# EAGLE design 20191118_GantryControl_v2 (EAGLE 9.5.1)
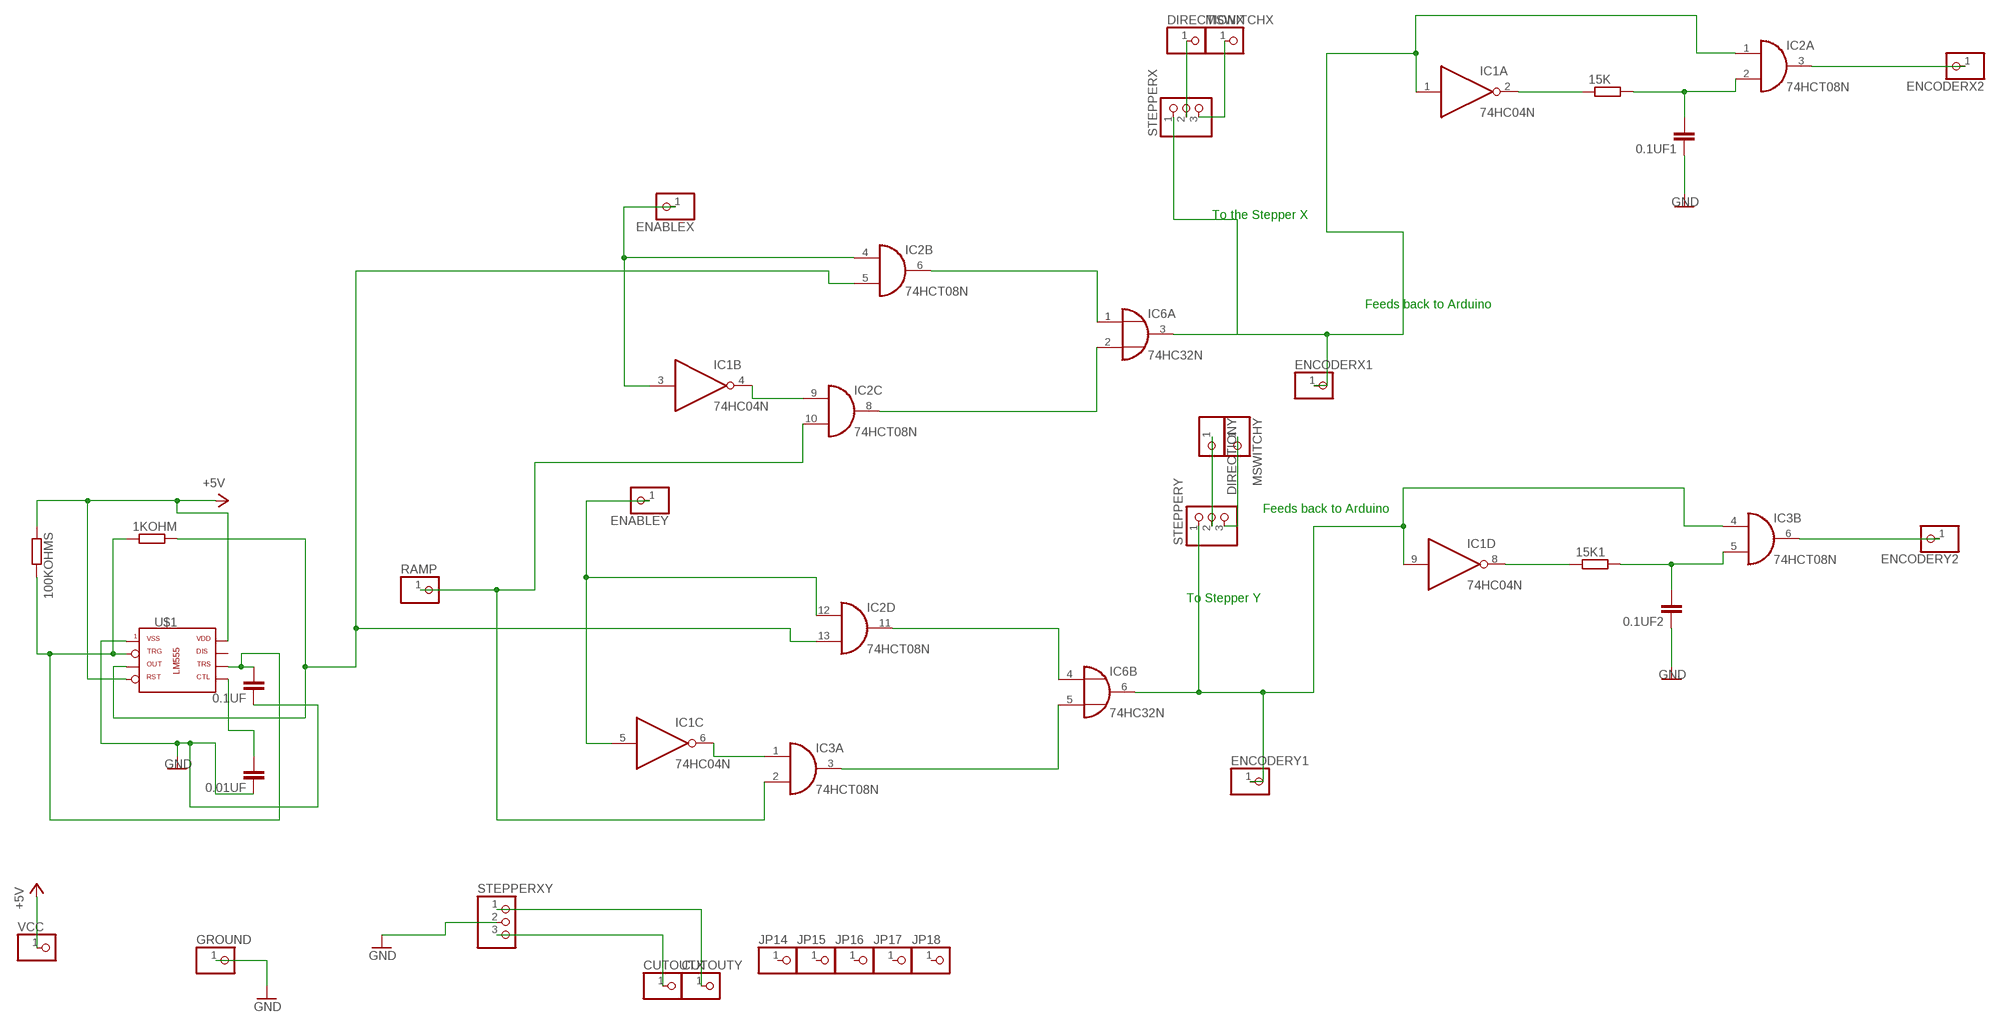
[diagram p0: schematic, sheet 1]

## Parts
0.01UF  C-EU102-064X133  [C102-064X133]
0.1UF  C-EU075-032X103  [C075-032X103]
0.1UF1  C-EU075-032X103  [C075-032X103]
0.1UF2  C-EU075-032X103  [C075-032X103]
1KOHM  R-EU_0207/12  [0207/12]
15K  R-EU_0207/10  [0207/10]
15K1  R-EU_0207/10  [0207/10]
100KOHMS  R-EU_0207/10  [0207/10]
CUTOUTX  PINHD-1X1  [1X01]
CUTOUTY  PINHD-1X1  [1X01]
DIRECTIONX  PINHD-1X1  [1X01]
DIRECTIONY  PINHD-1X1  [1X01]
ENABLEX  PINHD-1X1  [1X01]
ENABLEY  PINHD-1X1  [1X01]
ENCODERX1  PINHD-1X1  [1X01]
ENCODERX2  PINHD-1X1  [1X01]
ENCODERY1  PINHD-1X1  [1X01]
ENCODERY2  PINHD-1X1  [1X01]
GROUND  PINHD-1X1  [1X01]
IC1  74HC04N  [DIL14]
IC2  74HCT08N  [DIL14]
IC3  74HCT08N  [DIL14]
IC6  74HC32N  [DIL14]
JP14  PINHD-1X1  [1X01]
JP15  PINHD-1X1  [1X01]
JP16  PINHD-1X1  [1X01]
JP17  PINHD-1X1  [1X01]
JP18  PINHD-1X1  [1X01]
MSWITCHX  PINHD-1X1  [1X01]
MSWITCHY  PINHD-1X1  [1X01]
RAMP  PINHD-1X1  [1X01]
STEPPERX  PINHD-1X3  [1X03]
STEPPERXY  PINHD-1X3  [1X03]
STEPPERY  PINHD-1X3  [1X03]
U$1  -LM555  [DIL08]
VCC  PINHD-1X1  [1X01]

## Nets
+5V: 100KOHMS.1 U$1.4(RES) U$1.8(VCC) VCC.1
GND: 0.1UF1.1 0.1UF2.1 0.1UF.1 0.01UF.1 GROUND.1 STEPPERXY.2 U$1.1(GND)
N$1: 1KOHM.2 IC2.5(B:I1) IC2.13(D:I1) U$1.3(OUT)
N$2: 0.1UF.2 1KOHM.1 100KOHMS.2 U$1.2(TRG) U$1.6(TRS)
N$3: 0.01UF.2 U$1.5(CTL)
N$4: 15K.1 IC1.2(A:O)
N$5: ENCODERX1.1 IC1.1(A:I) IC2.1(A:I0) IC6.3(A:O) STEPPERX.1
N$6: 0.1UF1.2 15K.2 IC2.2(A:I1)
N$7: ENCODERY2.1 IC3.6(B:O)
N$8: ENABLEX.1 IC1.3(B:I) IC2.4(B:I0)
N$9: ENCODERX2.1 IC2.3(A:O)
N$10: IC2.10(C:I1) IC3.2(A:I1) RAMP.1
N$11: IC1.4(B:O) IC2.9(C:I0)
N$12: IC2.8(C:O) IC6.2(A:I1)
N$13: DIRECTIONY.1 STEPPERY.2
N$14: IC2.6(B:O) IC6.1(A:I0)
N$15: ENABLEY.1 IC1.5(C:I) IC2.12(D:I0)
N$16: MSWITCHY.1 STEPPERY.3
N$17: DIRECTIONX.1 STEPPERX.2
N$18: IC1.6(C:O) IC3.1(A:I0)
N$19: IC3.3(A:O) IC6.5(B:I1)
N$20: IC2.11(D:O) IC6.4(B:I0)
N$21: ENCODERY1.1 IC1.9(D:I) IC3.4(B:I0) IC6.6(B:O) STEPPERY.1
N$22: 15K1.1 IC1.8(D:O)
N$23: 0.1UF2.2 15K1.2 IC3.5(B:I1)
N$24: MSWITCHX.1 STEPPERX.3
N$27: CUTOUTX.1 STEPPERXY.3
N$28: CUTOUTY.1 STEPPERXY.1
Unconnected: IC1.10(E:O) IC1.11(E:I) IC1.12(F:O) IC1.13(F:I) IC3.8(C:O) IC3.9(C:I0) IC3.10(C:I1) IC3.11(D:O) IC3.12(D:I0) IC3.13(D:I1) IC6.8(C:O) IC6.9(C:I0) IC6.10(C:I1) IC6.11(D:O) IC6.12(D:I0) IC6.13(D:I1) JP14.1 JP15.1 JP16.1 JP17.1 JP18.1 U$1.7(DIS)

## Notes on the sheet
- To the Stepper X
- Feeds back to Arduino
- Feeds back to Arduino
- To Stepper Y

## Power pins joined to a net without a drawn wire
GND: IC1.7(P:GND) IC2.7(P:GND) IC3.7(P:GND) IC6.7(P:GND)
VCC: IC1.14(P:VCC) IC2.14(P:VCC) IC3.14(P:VCC) IC6.14(P:VCC)

## Library data of the parts
0.01UF 0.1UF 0.1UF1 0.1UF2 = rcl:C-EU: CAPACITOR, European symbol; SPICEPREFIX: C
1KOHM 15K 15K1 100KOHMS = rcl:R-EU_: RESISTOR, European symbol; SPICEPREFIX: R
CUTOUTX CUTOUTY DIRECTIONX DIRECTIONY ENABLEX ENABLEY ENCODERX1 ENCODERX2 ENCODERY1 ENCODERY2 GROUND JP14-JP18 MSWITCHX MSWITCHY RAMP VCC = pinhead:PINHD-1X1: PIN HEADER
IC1 = 74xx-eu:74*04: Hex INVERTER
IC2 IC3 = 74xx-eu:74*08: Quad 2-input AND gate
IC6 = 74xx-eu:74*32: Quad 2-input OR gate
STEPPERX STEPPERXY STEPPERY = pinhead:PINHD-1X3: PIN HEADER
U$1 = tango:-LM555

## Module LM555
Ports: 

### Library data of the parts

## Board
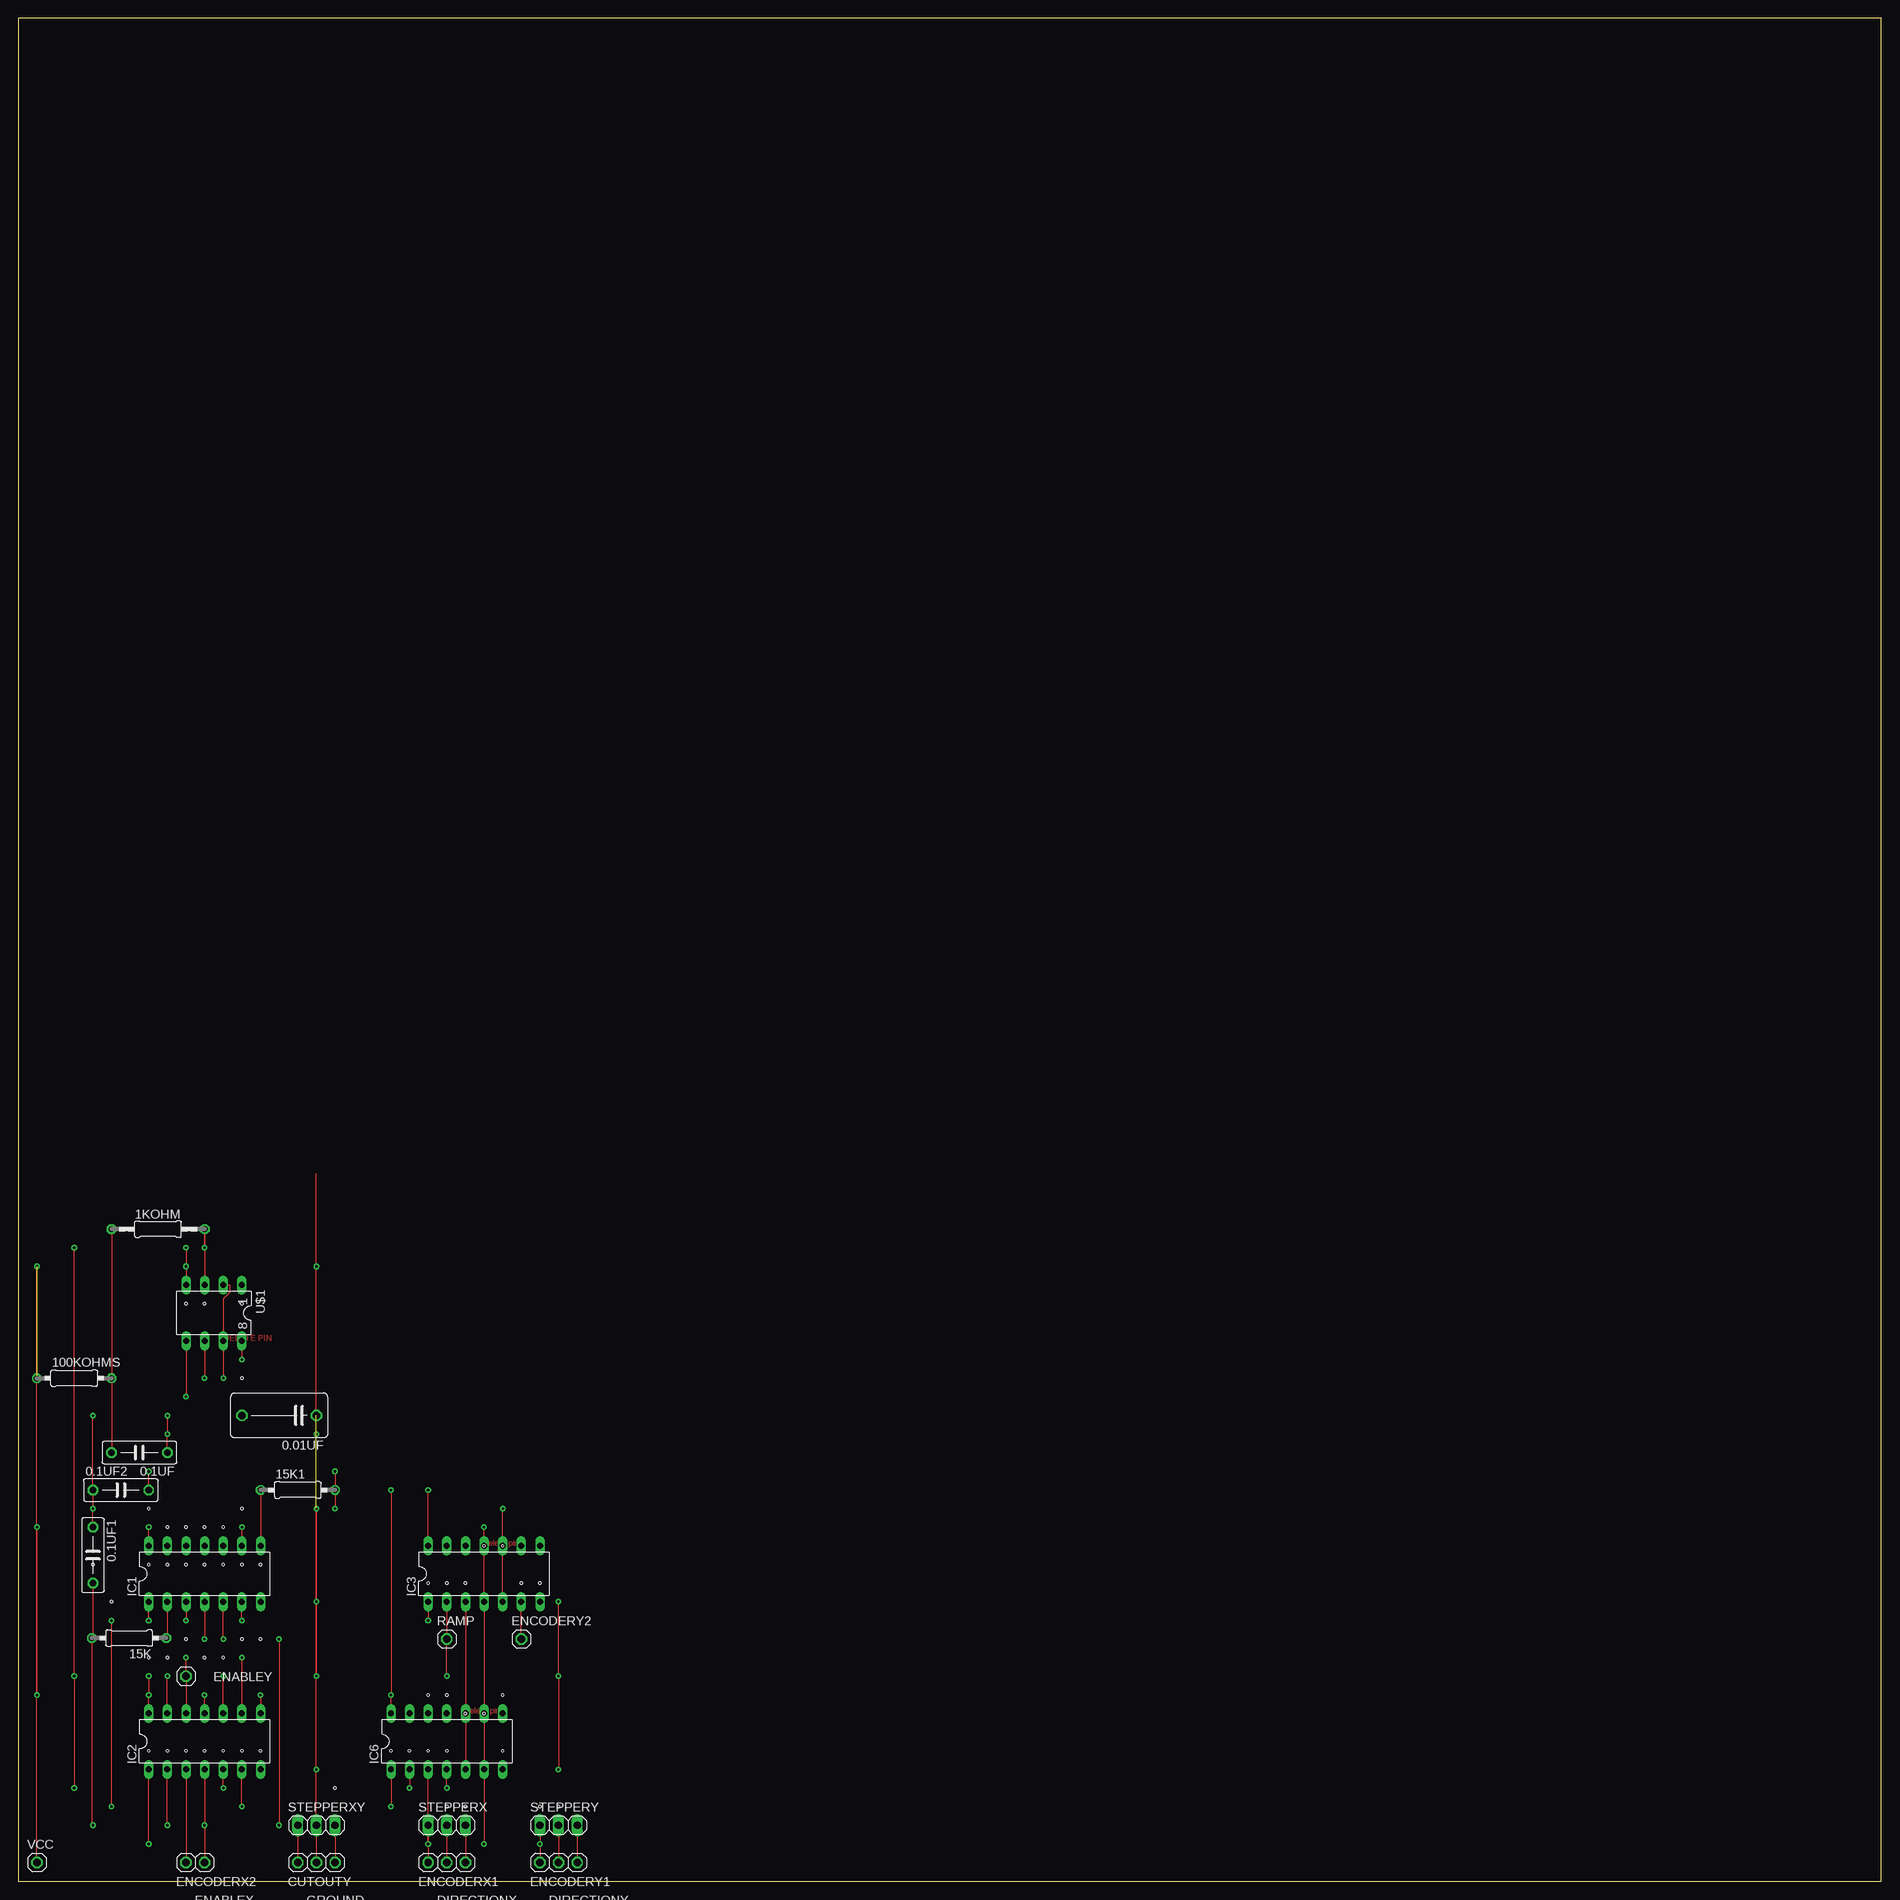
[diagram p1: board, top side]
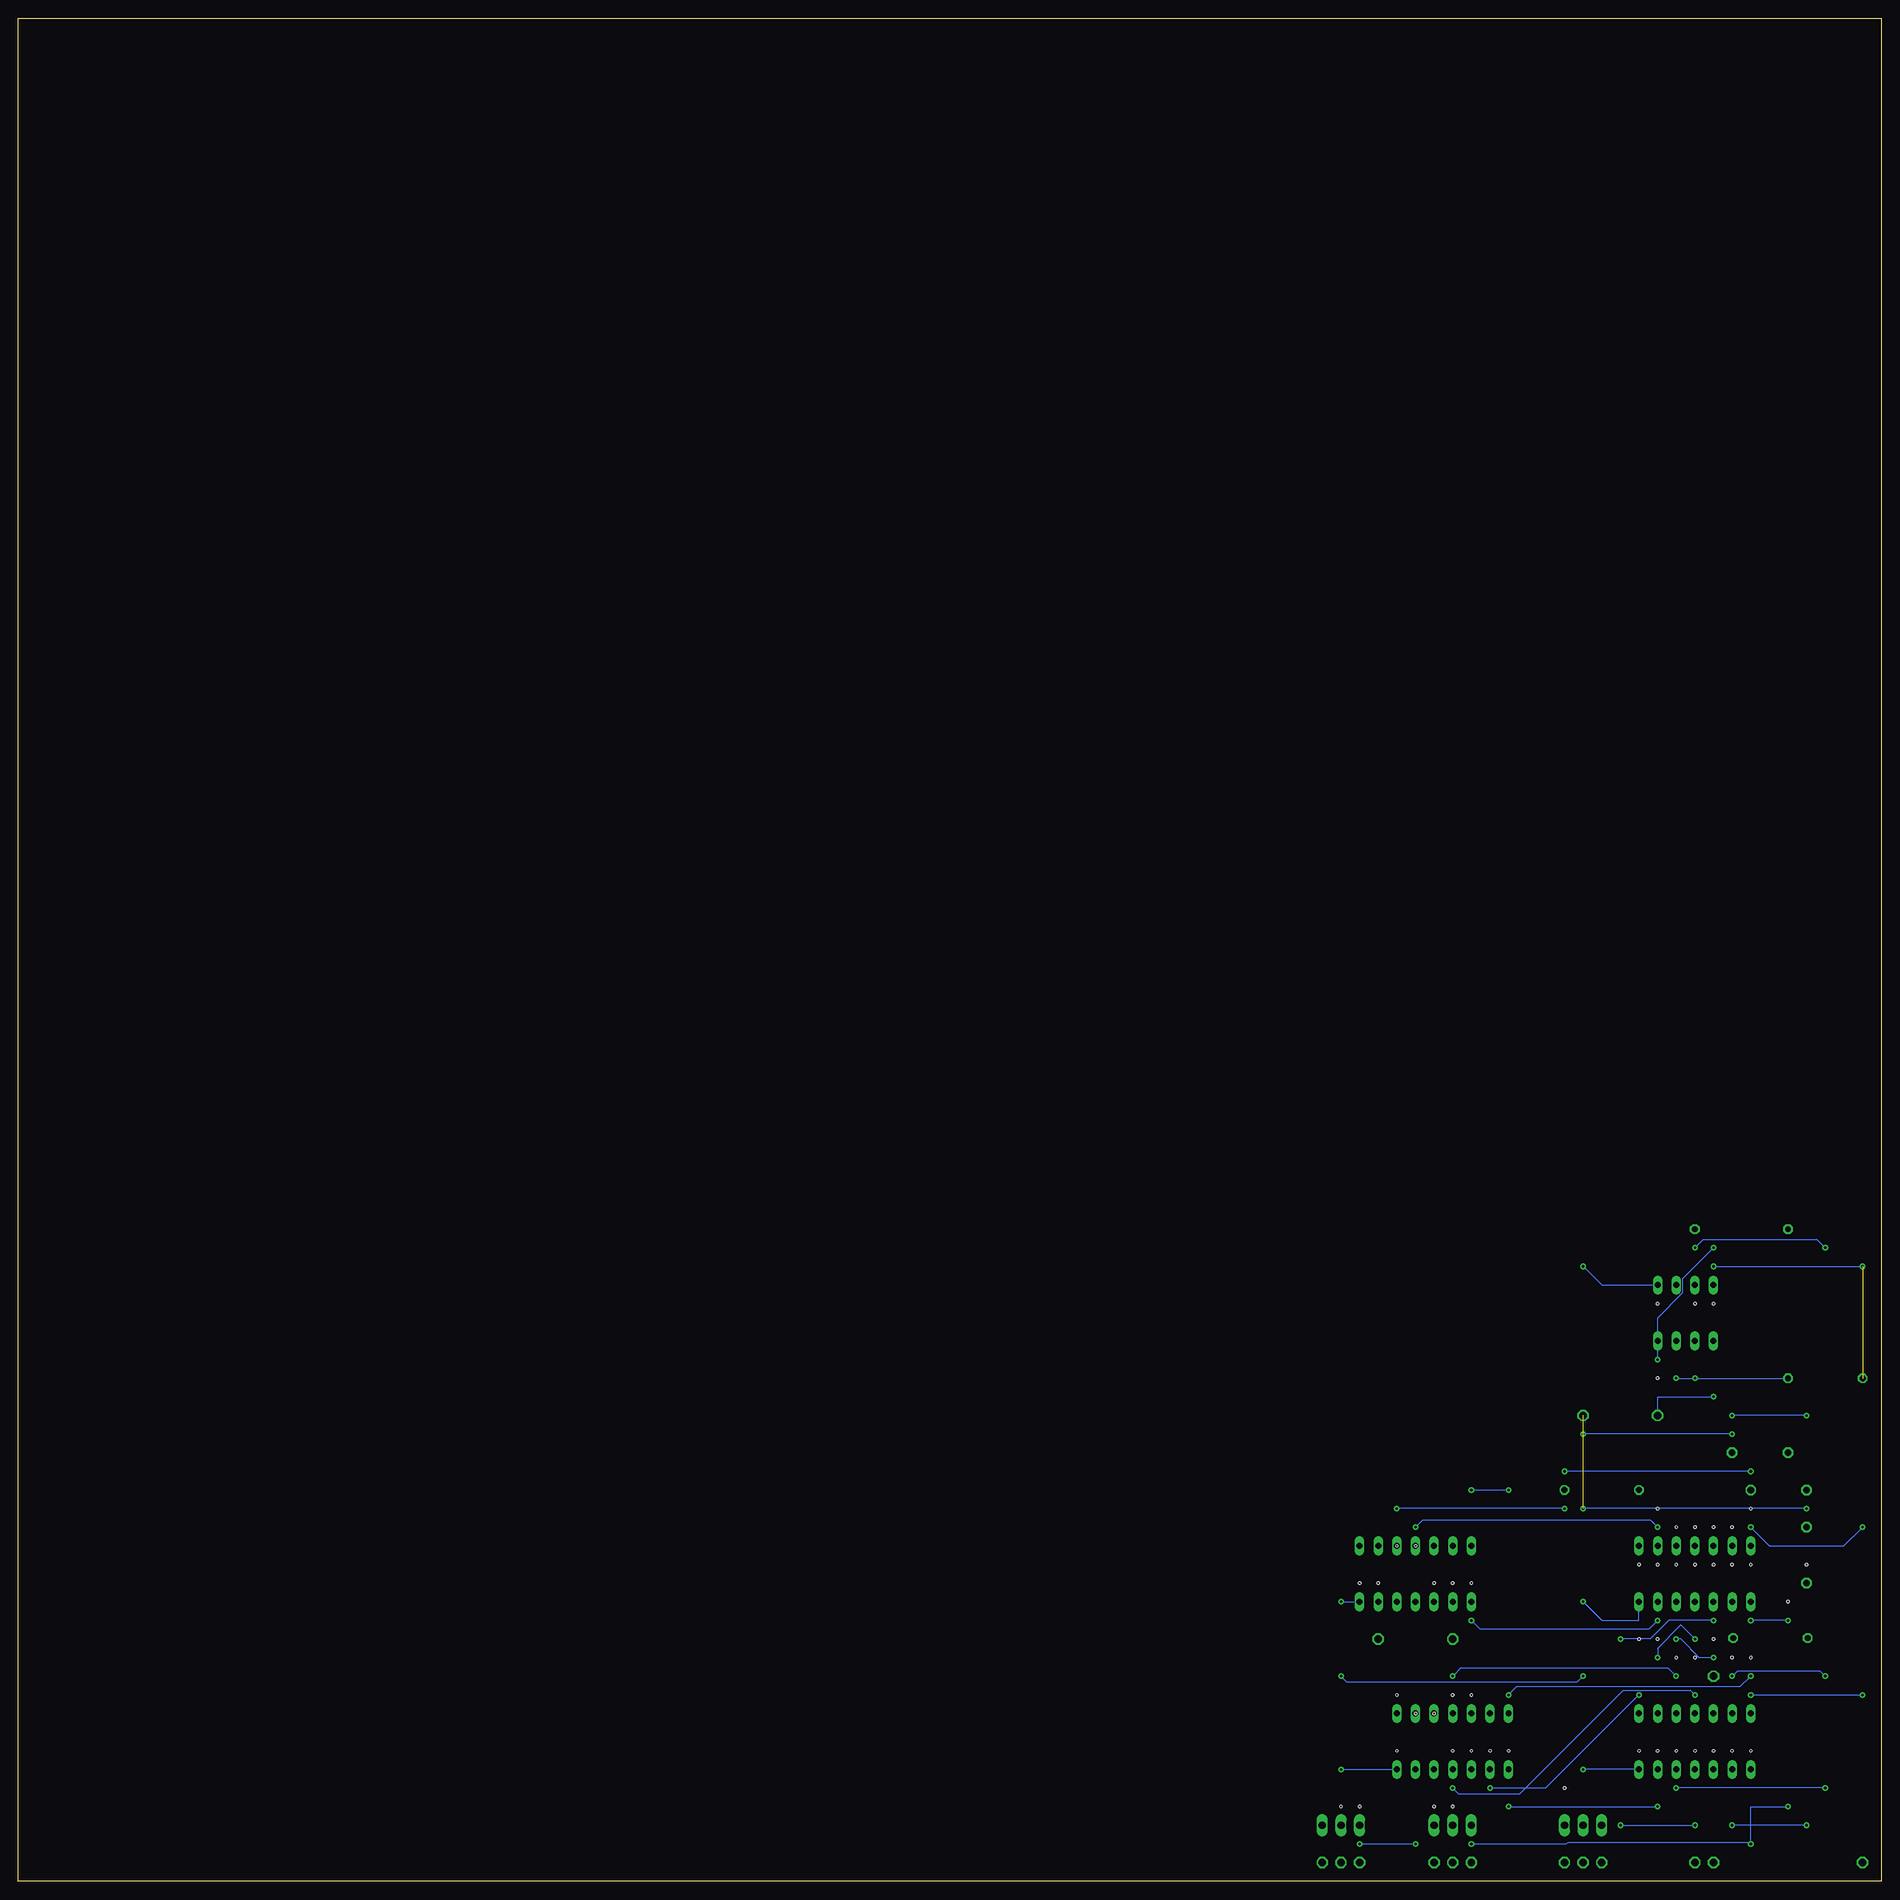
[diagram p2: board, bottom side, seen from below]

Size 254 x 254 mm. Coordinates in mm from the lower left corner, seen from the top.
Outline: 0,0 254,0 254,254 0,254 0,0
Copper layers (1*16): Top 0.035mm / dielectric 1.5mm / Bottom 0.035mm
Design rules "default": minimum track width 6mil, minimum drill 0.35mm, track to track 6mil, track to pad 6mil, pad to pad 6mil, via to via 6mil, smd to smd 6mil, copper to edge 40mil, drill to drill 6mil, minimum pad ring 10mil, minimum via ring 8mil, stop-mask expansion 4mil, vias tented up to drill 0mil, thermal gap 10mil
Holes 0.35 mm at 60.96,22.86 63.5,22.86 63.5,45.72 66.04,45.72 10.16,43.18 12.7,38.1 17.78,50.8 17.78,43.18 17.78,30.48 17.78,17.78 20.32,17.78 20.32,30.48 20.32,43.18 20.32,48.26 22.86,48.26 25.4,48.26 27.94,48.26 22.86,43.18 25.4,43.18 27.94,43.18 22.86,78.74 22.86,33.02 22.86,17.78 25.4,17.78 25.4,30.48 25.4,78.74 27.94,30.48 27.94,17.78 30.48,17.78 30.48,33.02 30.48,43.18 30.48,50.8 30.48,68.58 30.48,78.74 33.02,43.18 33.02,33.02 33.02,17.78 43.18,12.7 50.8,17.78 53.34,17.78 55.88,17.78 55.88,25.4 55.88,40.64 58.42,40.64 58.42,25.4 58.42,17.78 58.42,10.16 60.96,10.16 60.96,40.64 66.04,17.78 66.04,25.4 68.58,40.64 71.12,10.16 71.12,40.64 73.66,10.16

### Footprints (pad centres in the part's own frame; a part is rotated, then mirrored left to right if it is on the bottom)
C102-064X133 = drill 1.016 octagon: 1 -5.08,0; 2 5.08,0
C075-032X103 = drill 0.914 octagon: 1 -3.81,0; 2 3.81,0
0207/12 = drill 0.813 octagon: 1 -6.35,0; 2 6.35,0
0207/10 = drill 0.813 octagon: 1 -5.08,0; 2 5.08,0
1X01 = drill 1.016 octagon: 1 0,0
DIL14 = drill 0.813 long: 1 -7.62,-3.81; 2 -5.08,-3.81; 3 -2.54,-3.81; 4 0,-3.81; 5 2.54,-3.81; 6 5.08,-3.81; 7 7.62,-3.81; 8 7.62,3.81; 9 5.08,3.81; 10 2.54,3.81; 11 0,3.81; 12 -2.54,3.81; 13 -5.08,3.81; 14 -7.62,3.81
1X03 = drill 1.016 long: 1 -2.54,0; 2 0,0; 3 2.54,0
DIL08 = drill 0.813 long: 1 -3.81,-3.81; 2 -1.27,-3.81; 3 1.27,-3.81; 4 3.81,-3.81; 5 3.81,3.81; 6 1.27,3.81; 7 -1.27,3.81; 8 -3.81,3.81

### Placement (x,y rotation side)
0.01UF  35.56,63.5 180 top
0.1UF  16.51,58.42 180 top
0.1UF1  10.16,44.45 270 top
0.1UF2  13.97,53.34 0 top
1KOHM  19.05,88.9 0 top
15K  15.11,33.15 180 top
15K1  38.1,53.34 0 top
100KOHMS  7.62,68.58 0 top
CUTOUTX  43.18,2.54 0 top
CUTOUTY  38.1,2.54 0 top
DIRECTIONX  58.42,2.54 0 top
DIRECTIONY  73.66,2.54 0 top
ENABLEX  25.4,2.54 0 top
ENABLEY  22.86,27.94 0 top
ENCODERX1  55.88,2.54 0 top
ENCODERX2  22.86,2.54 0 top
ENCODERY1  71.12,2.54 0 top
ENCODERY2  68.58,33.02 0 top
GROUND  40.64,2.54 0 top
IC1  25.4,41.91 0 top
IC2  25.4,19.05 0 top
IC3  63.5,41.91 0 top
IC6  58.42,19.05 0 top
JP14  58.42,-10.16 0 top  (outside the outline)
JP15  33.02,-10.16 0 top  (outside the outline)
JP16  53.34,-10.16 0 top  (outside the outline)
JP17  45.72,-10.16 0 top  (outside the outline)
JP18  38.1,-10.16 0 top  (outside the outline)
MSWITCHX  60.96,2.54 0 top
MSWITCHY  76.2,2.54 0 top
RAMP  58.42,33.02 0 top
STEPPERX  58.42,7.62 0 top
STEPPERXY  40.64,7.62 0 top
STEPPERY  73.66,7.62 0 top
U$1  26.67,77.47 180 top
VCC  2.54,2.54 0 top

### Tracks (layer width: path | path; a pad name or v marks a point on that pad's centre or on a via)
+5V  (via drill 0.35)  (1 unrouted)
  Top 0.152: VCC.1 v2.54,83.82 | U$1.8 v30.48,71.12 | U$1.4 v22.86,83.82 v22.86,86.36
  Bottom 0.152: v30.48,71.12 30.48,76.82 27.05,80.25 27.05,82.17 v22.86,86.36 | v22.86,83.82 v2.54,83.82
GND  (via drill 0.35)  (1 unrouted)
  Top 0.152: 40.64,96.52 v40.64,83.82 v40.64,27.94 v40.64,50.8 v40.64,38.1 v40.64,15.24 STEPPERXY.2 GROUND.1 | 0.1UF1.1 v10.16,50.8 0.1UF2.1 v10.16,63.5 | v73.66,38.1 v73.66,27.94 v73.66,15.24 | v20.32,63.5 v20.32,60.96 0.1UF.1
  Bottom 0.152: IC2.7 v40.64,15.24 | v40.64,38.1 38.1,35.56 33.02,35.56 IC1.7 | v40.64,83.82 38.1,81.28 U$1.1 | v10.16,50.8 v40.64,50.8 | v73.66,27.94 72.9,27.18 41.4,27.18 v40.64,27.94 | v73.66,38.1 IC3.7 | v73.66,15.24 IC6.7 | v10.16,63.5 v20.32,63.5
N$1  (via drill 0.35)
  Top 0.152: U$1.3 1KOHM.2 v25.4,86.36 | IC2.13 v20.32,27.94 | v27.94,12.7 IC2.5 | v7.62,12.7 v7.62,27.94 v7.62,86.36
  Bottom 0.152: v20.32,27.94 19.56,28.7 8.38,28.7 v7.62,27.94 | v7.62,12.7 v27.94,12.7 | v25.4,86.36 24.26,87.5 8.76,87.5 v7.62,86.36
N$2  (via drill 0.35)
  Top 0.152: U$1.6 v25.4,68.58 | 0.1UF.2 100KOHMS.2 1KOHM.1 | U$1.2 28.83,81.28 28.83,80.25 27.94,79.36 v27.94,68.58
  Bottom 0.152: 100KOHMS.2 v25.4,68.58 v27.94,68.58
N$3  (via drill 0.35)
  Top 0.152: U$1.5 v22.86,66.04
  Bottom 0.152: 0.01UF.2 30.48,66.04 v22.86,66.04
N$4
  Top 0.152: IC1.2 20.32,33.27 15K.1
N$5  (via drill 0.35)
  Top 0.152: ENCODERX1.1 STEPPERX.1 v55.88,5.08 IC6.3 | v17.78,5.08 IC2.1 | v12.7,10.16 v12.7,35.56 | v17.78,35.56 IC1.1
  Bottom 0.152: v55.88,5.08 42.93,5.08 42.67,5.33 18.03,5.33 v17.78,5.08 17.78,10.16 v12.7,10.16 | v12.7,35.56 v17.78,35.56
N$6  (via drill 0.35)
  Top 0.152: 15K.2 10.03,33.02 | 10.03,33.02 10.03,7.75 v10.16,7.62 | v20.32,7.62 IC2.2 | 0.1UF1.2 10.16,33.02 10.03,33.02
  Bottom 0.152: v10.16,7.62 v20.32,7.62
N$7
  Top 0.152: ENCODERY2.1 IC3.6
N$8  (via drill 0.35)
  Top 0.152: IC2.4 v25.4,7.62 ENABLEX.1 | IC1.3 v22.86,35.56 | v35.56,33.02 v35.56,7.62
  Bottom 0.152: v22.86,35.56 28.96,35.56 31.5,33.02 v35.56,33.02 | v35.56,7.62 v25.4,7.62
N$9
  Top 0.152: IC2.3 ENCODERX2.1
N$10  (via drill 0.35)
  Top 0.152: IC3.2 RAMP.1 v58.42,27.94 | IC2.10 v27.94,27.94
  Bottom 0.152: v27.94,27.94 29.08,29.08 57.28,29.08 v58.42,27.94
N$11  (via drill 0.35)
  Top 0.152: IC1.4 v25.4,33.02 | v30.48,30.48 IC2.9
  Bottom 0.152: v25.4,33.02 27.3,34.92 30.48,31.75 v30.48,30.48
N$12  (via drill 0.35)
  Top 0.152: IC6.2 v53.34,12.7 | v33.02,25.4 IC2.8
  Bottom 0.152: v53.34,12.7 45.72,12.7 v33.02,25.4
N$13
  Top 0.152: STEPPERY.2 DIRECTIONY.1
N$14  (via drill 0.35)
  Top 0.152: IC6.1 v50.8,10.16 | v30.48,10.16 IC2.6
  Bottom 0.152: v50.8,10.16 v30.48,10.16
N$15  (via drill 0.35)
  Top 0.152: IC2.12 ENABLEY.1 v22.86,30.48 | v27.94,33.02 IC1.5
  Bottom 0.152: v22.86,30.48 24.77,30.48 27.3,33.02 v27.94,33.02
N$16
  Top 0.152: STEPPERY.3 MSWITCHY.1
N$17
  Top 0.152: STEPPERX.2 DIRECTIONX.1
N$18  (via drill 0.35)
  Top 0.152: IC3.1 v55.88,35.56 | v30.48,35.56 IC1.6
  Bottom 0.152: v30.48,35.56 31.62,34.42 54.74,34.42 v55.88,35.56
N$19
  Top 0.152: IC3.3 IC6.5
N$20  (via drill 0.35)
  Top 0.152: IC2.11 v25.4,25.4 | v58.42,12.7 IC6.4
  Bottom 0.152: v25.4,25.4 26.04,26.04 35.18,26.04 49.28,11.94 57.66,11.94 v58.42,12.7
N$21  (via drill 0.35)
  Top 0.152: STEPPERY.1 v71.12,5.08 ENCODERY1.1 | v63.5,5.08 IC6.6 IC3.4 v63.5,48.26 | v30.48,48.26 IC1.9
  Bottom 0.152: v71.12,5.08 v63.5,5.08 | v63.5,48.26 62.48,49.28 31.5,49.28 v30.48,48.26
N$22
  Top 0.152: 15K1.1 IC1.8
N$23  (via drill 0.35)
  Top 0.152: IC3.5 v66.04,50.8 | v43.18,50.8 15K1.2 v43.18,55.88 | 0.1UF2.2 v17.78,55.88
  Bottom 0.152: v43.18,50.8 v66.04,50.8 | v17.78,55.88 v43.18,55.88
N$24
  Top 0.152: STEPPERX.3 MSWITCHX.1
N$25  (via drill 0.35)
  Bottom 0.152: 20.32,60.96 v40.64,60.96
N$27
  Top 0.152: STEPPERXY.3 CUTOUTX.1
N$28
  Top 0.152: STEPPERXY.1 CUTOUTY.1
VCC  (via drill 0.35)
  Top 0.152: IC2.14 v17.78,25.4 v17.78,27.94 | IC1.14 v17.78,48.26 | v2.54,48.26 v2.54,25.4 | IC6.14 v50.8,25.4 v50.8,53.34 | IC3.14 v55.88,53.34
  Bottom 0.152: v17.78,25.4 v2.54,25.4 | v2.54,48.26 5.08,45.72 15.24,45.72 v17.78,48.26 | v50.8,25.4 49.66,26.54 19.18,26.54 v17.78,27.94 | v55.88,53.34 v50.8,53.34

### Text on the board
Top: DELETE PIN | delete pin | delete pin